# Altium schematic sheet I2C_example.SchDoc
size A3; SheetNumber: 8; SheetTotal: 8
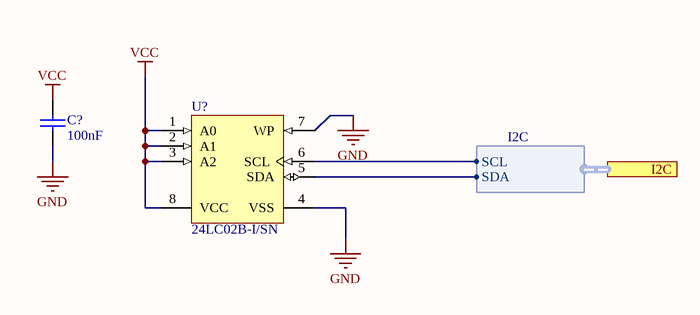
[diagram p0: I2C_example.SchDoc]

## Parts
C?  100nF
U?  24LC02B-I/SN  [SOIC-SN8_N]

## Ports
I2C (harness I2C)

## Harnesses
I2C: SDA, SCL

## Nets
GND: C?.1 U?.4(VSS) U?.7(WP)
VCC: C?.2 U?.1(A0) U?.2(A1) U?.3(A2) U?.8(VCC)
NetU?_5: U?.5(SDA) ; port I2C.SDA
NetU?_6: U?.6(SCL) ; port I2C.SCL

## Library data of the parts
C? = 100nF: Capacitor; Published: 8-Jun-2000; LatestRevisionDate: 17-Jul-2002; LatestRevisionNote: Re-released for DXP Platform.; PackageReference: RAD-0.3; Publisher: Altium Limited; PackageDescription: Radial Cap, Thru-Hole; 2 Leads; 0.3 in Pin Spacing
U? = CMP-0159-00332-1: 2Kbit, 400kHz, 2.5V, I2C Serial EEPROM, 8-Pin SOIC 150mil, Industrial Temperature; PackageReference: SOIC-SN8; Code_JEDEC: MS-012; DatasheetVersion: revJ, Feb-2009; Code_IPC: SOIC127P600-8; PackageVersion: revBB, Aug-2009; PackageDescription: 8-Lead Plastic Small Outline (SN) - Narrow, 3.90mm Body [SOIC]